# EAGLE schematic expansion_can_rev_B (EAGLE 6.6.0)

## Sheet 1 of 2
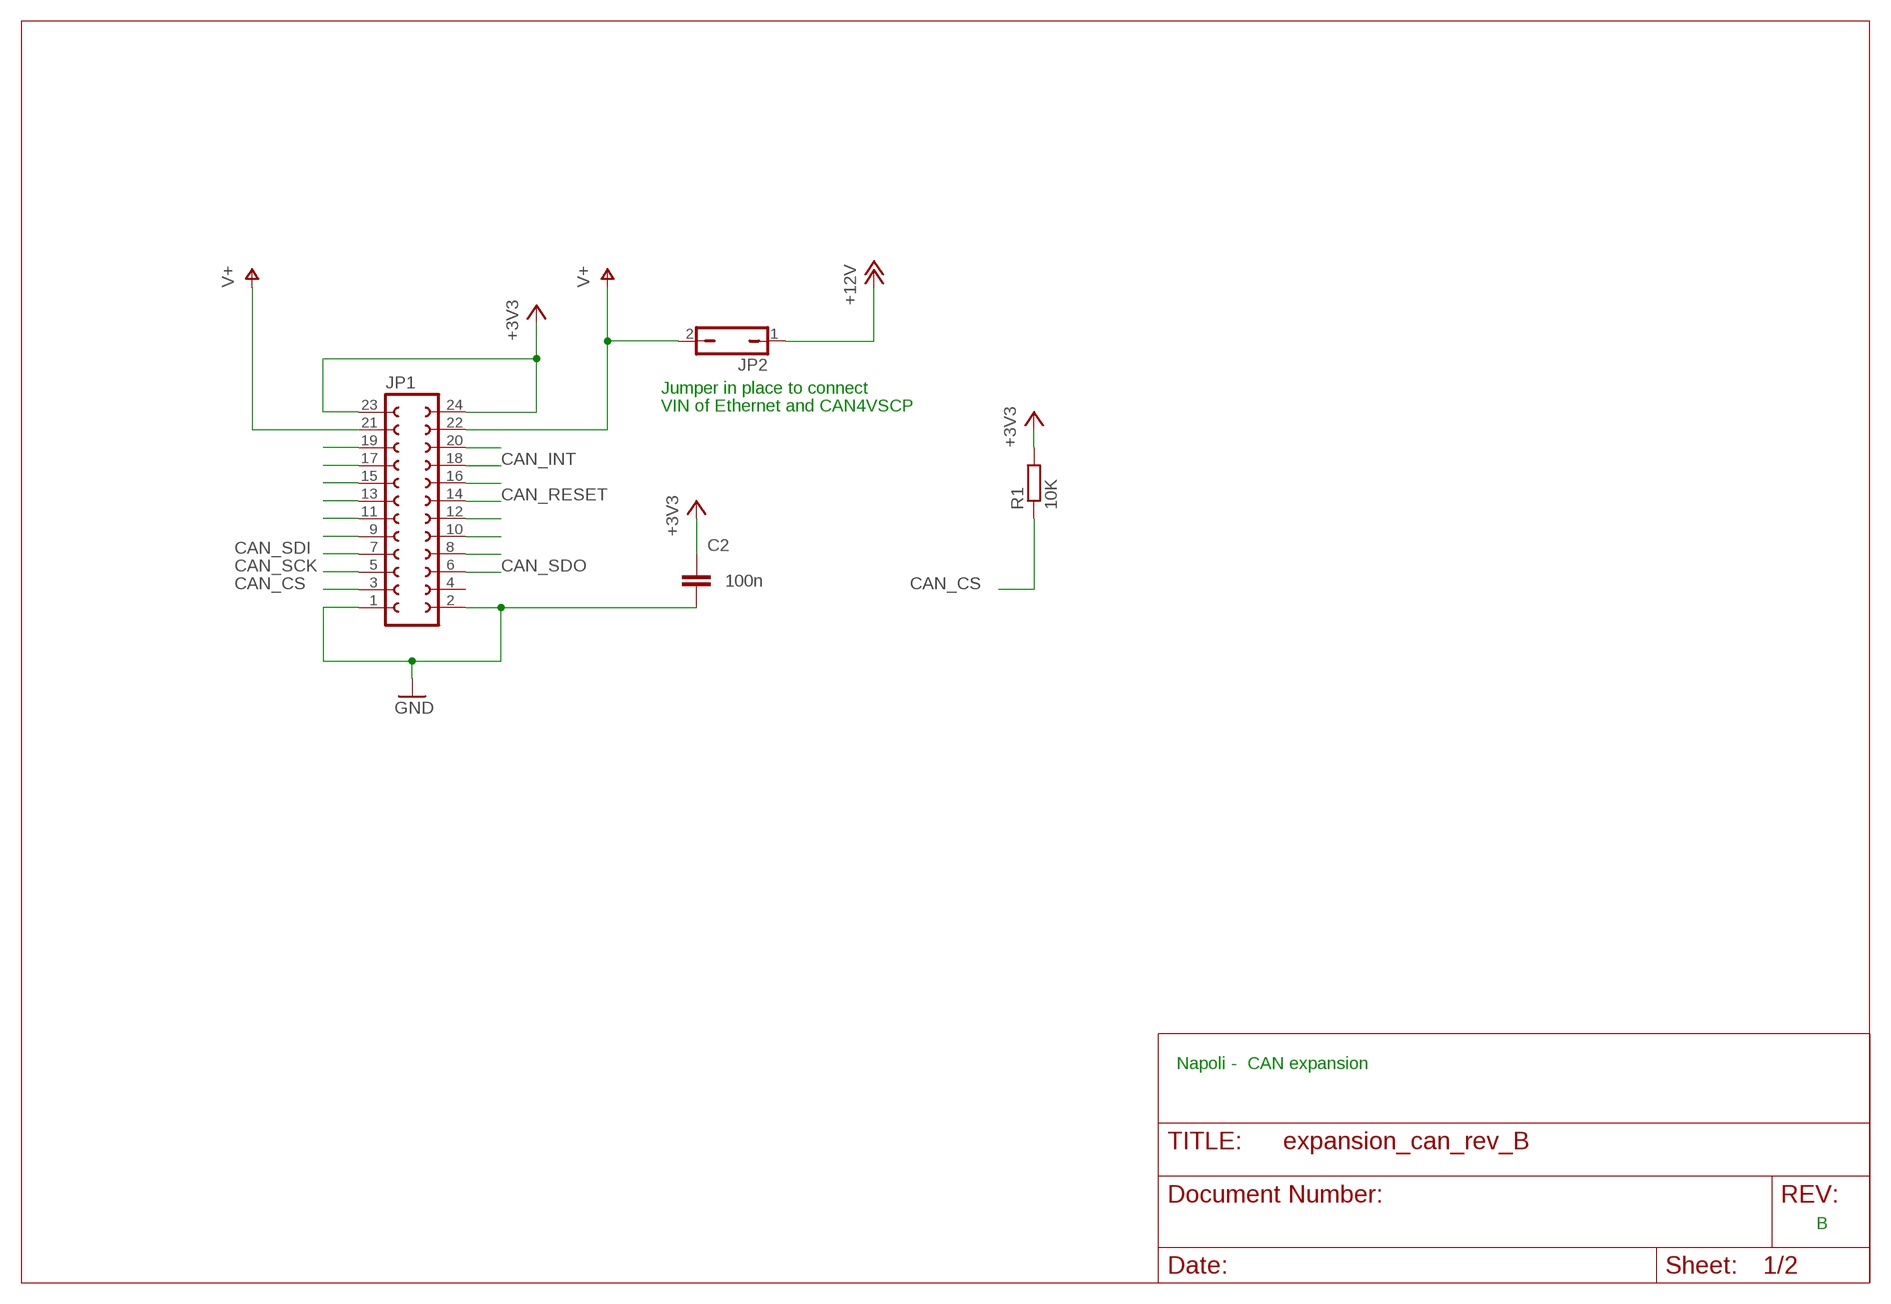
[diagram p0: schematic, sheet 1]

### Parts
C2  100n  C-EUC0805  [C0805]
JP1  FE12-2  [FE12-2]
JP2  JP1Q  [JP1]
R1  10K  R-EU_R0805  [R0805]

### Nets
+3V3: C2.1 JP1.23 JP1.24 R1.2 ; also sheet 2
+12V: JP2.1 ; also sheet 2
CAN_CS: JP1.3 R1.1 ; also sheet 2
CAN_INT: JP1.18 ; also sheet 2
CAN_RESET: JP1.14 ; also sheet 2
CAN_SCK: JP1.5 ; also sheet 2
CAN_SDI: JP1.7 ; also sheet 2
CAN_SDO: JP1.6 ; also sheet 2
GND: C2.2 JP1.1 JP1.2 ; also sheet 2
N$10: JP1.20
N$12: JP1.16
N$14: JP1.12
N$15: JP1.10
N$16: JP1.8
N$22: JP1.19
N$23: JP1.17
N$24: JP1.15
N$25: JP1.13
N$26: JP1.11
N$27: JP1.9
VIN: JP1.21 JP1.22 JP2.2 ; supply symbol labelled V+
Unconnected: JP1.4

### Notes on the sheet
- Jumper in place to connect
- VIN of Ethernet and CAN4VSCP
- Napoli -  CAN expansion
- B

## Sheet 2 of 2
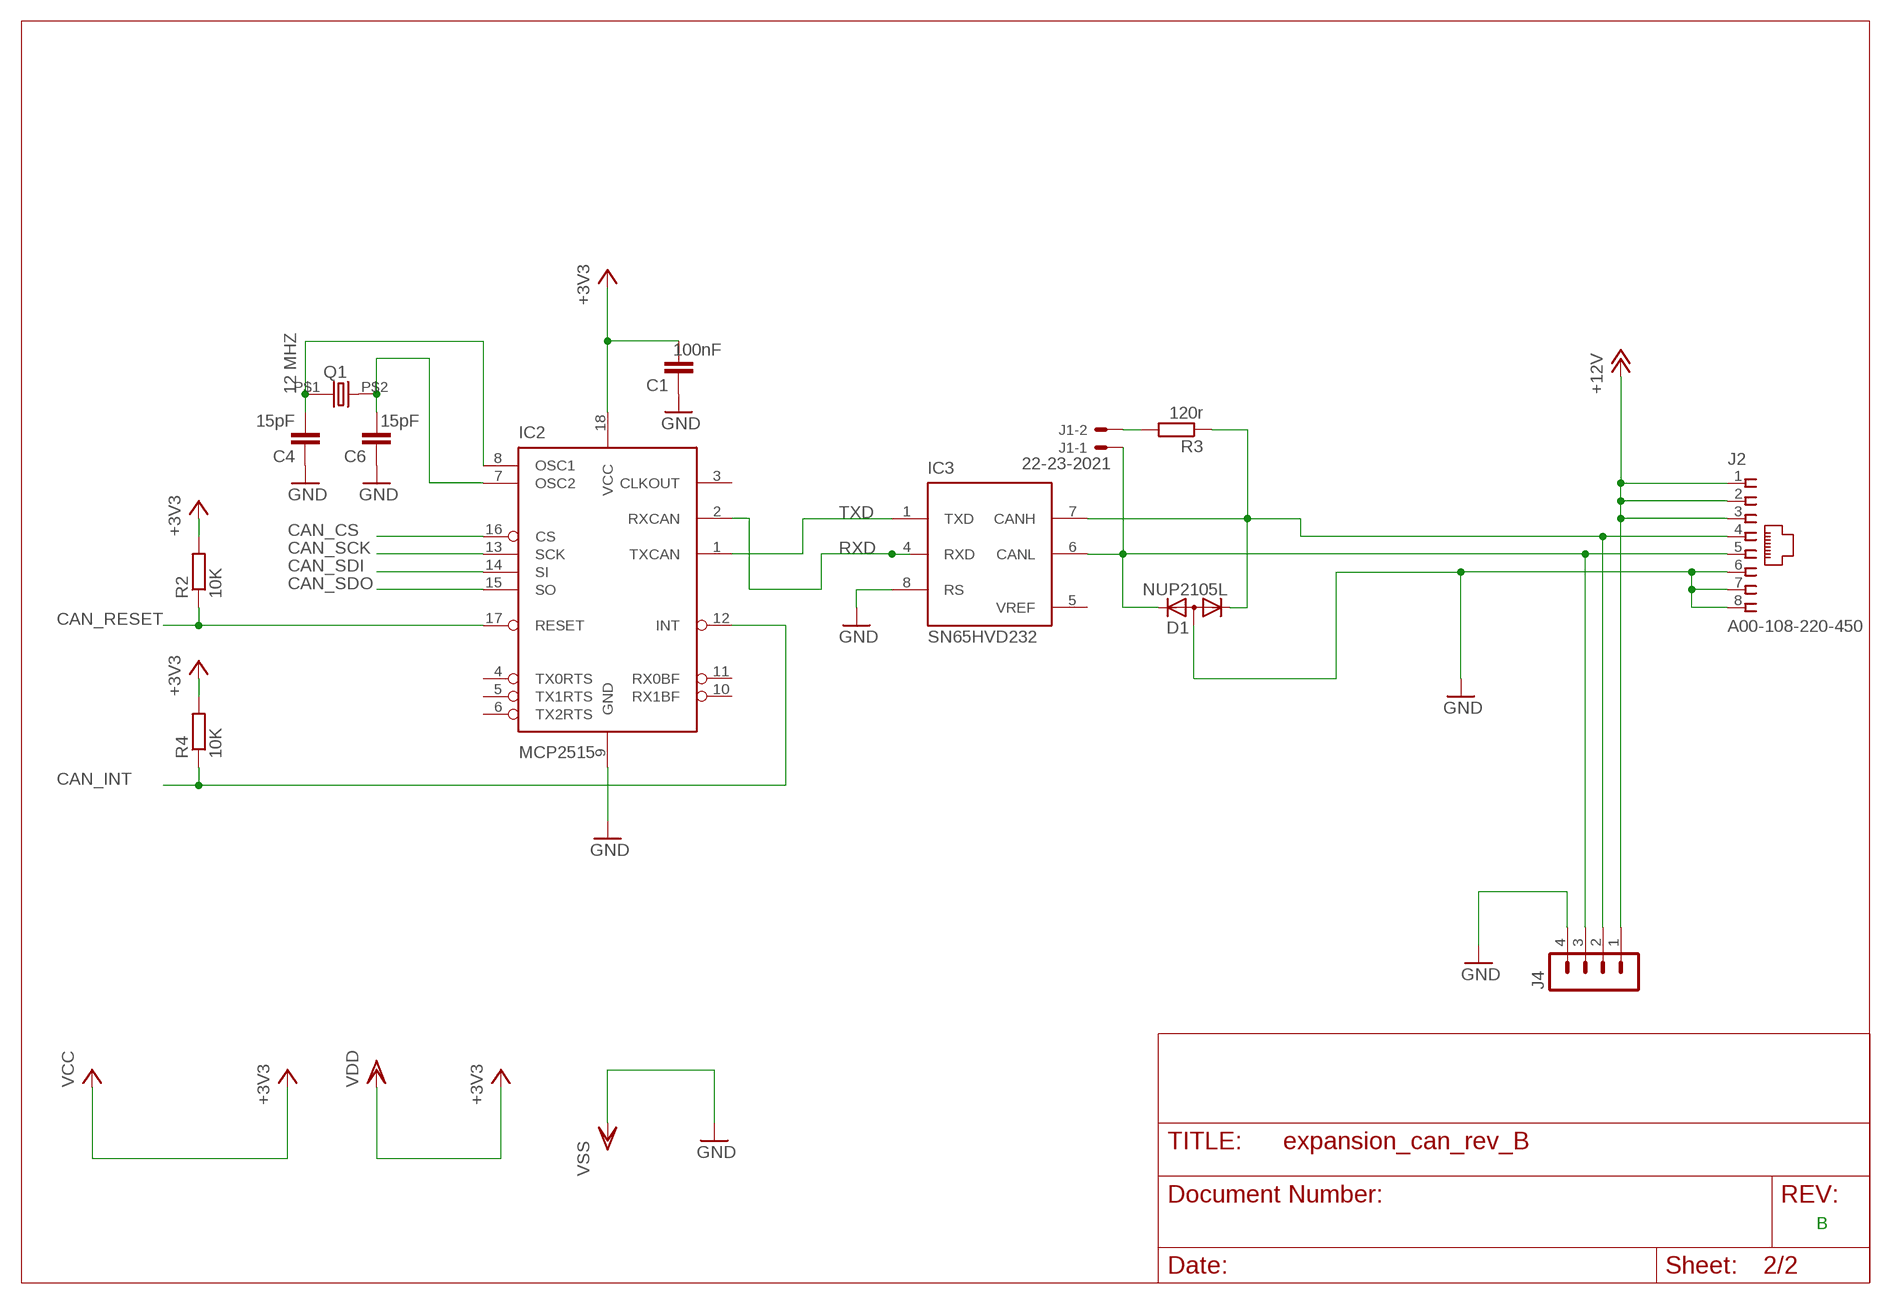
[diagram p1: schematic, sheet 2]

### Parts
C1  100nF  C-EUC0805  [C0805]
C4  15pF  C-EUC0805  [C0805]
C6  15pF  C-EUC0805  [C0805]
D1  NUP2105L  DIODE-2CA|ACSOT23  [SOT23]
IC2  MCP2515  [SO-18W]
IC3  SN65HVD232  MCP2551SN  [SO-08]
J1  22-23-2021  [22-23-2021]
J2  A00-108-220-450  [RJ-45]
J4  MA04-1  [MA04-1]
Q1  12 MHZ  HC-49S  [9C]
R2  10K  R-EU_R0805  [R0805]
R3  120r  R-EU_R0805  [R0805]
R4  10K  R-EU_R0805  [R0805]

### Nets
+3V3: C1.2 IC2.18(VCC) R2.2 R4.2 ; supply symbol labelled VCC, VDD ; also sheet 1
+12V: J2.1 J2.2 J2.3 J4.1 ; also sheet 1
CAN_CS: IC2.16(CS) ; also sheet 1
CAN_INT: IC2.12(INT) R4.1 ; also sheet 1
CAN_RESET: IC2.17(RESET) R2.1 ; also sheet 1
CAN_SCK: IC2.13(SCK) ; also sheet 1
CAN_SDI: IC2.14(SI) ; also sheet 1
CAN_SDO: IC2.15(SO) ; also sheet 1
CANH: D1.1(K1) IC3.7(CANH) J2.4 J4.2 R3.1
CANL1: D1.2(K2) IC3.6(CANL) J1.1 J2.5 J4.3
GND: C1.1 C4.1 C6.1 D1.3(A) IC2.9(GND) IC3.8(RS) J2.6 J2.7 J2.8 J4.4 ; supply symbol labelled VSS ; also sheet 1
N$1: J1.2 R3.2
N$2: C4.2 IC2.8(OSC1) Q1.P$1
N$7: C6.2 IC2.7(OSC2) Q1.P$2
RXD: IC2.2(RXCAN) IC3.4(RXD)
TXD: IC2.1(TXCAN) IC3.1(TXD)
Unconnected: IC2.3(CLKOUT) IC2.4(TX0RTS) IC2.5(TX1RTS) IC2.6(TX2RTS) IC2.10(RX1BF) IC2.11(RX0BF)

### Notes on the sheet
- B

## Power pins joined to a net without a drawn wire
VDD: IC3.3(VDD)
VREF: IC3.5(VREF)
VSS: IC3.2(VSS)

## Library data of the parts
C1 C2 C4 C6 = rcl:C-EU: CAPACITOR, European symbol
D1 = diode:DIODE-2CA|AC: Dual DIODE Cathode-Anode|Anode-Cathode
IC2 = vscpcan:MCP2515
IC3 = microchip_can:MCP2551: High Speed CAN tranceiver
J1 = con-molex:22-23-2021: .100" (2.54mm) Center Header - 2 Pin; MF: MOLEX; MPN: 22-23-2021; OC_FARNELL: 1462926; OC_NEWARK: 25C3832
J2 = vscpcan:A00-108-220-450
J4 = con-lstb:MA04-1: PIN HEADER; OC_FARNELL: unknown; OC_NEWARK: unknown
JP1 = con-lsta:FE12-2: FEMALE HEADER; OC_FARNELL: unknown; OC_NEWARK: unknown
JP2 = jumper:JP1Q: JUMPER
Q1 = vscpcan:HC-49S: Digikey 887-1050-1-nd
R1-R4 = rcl:R-EU_: RESISTOR, European symbol